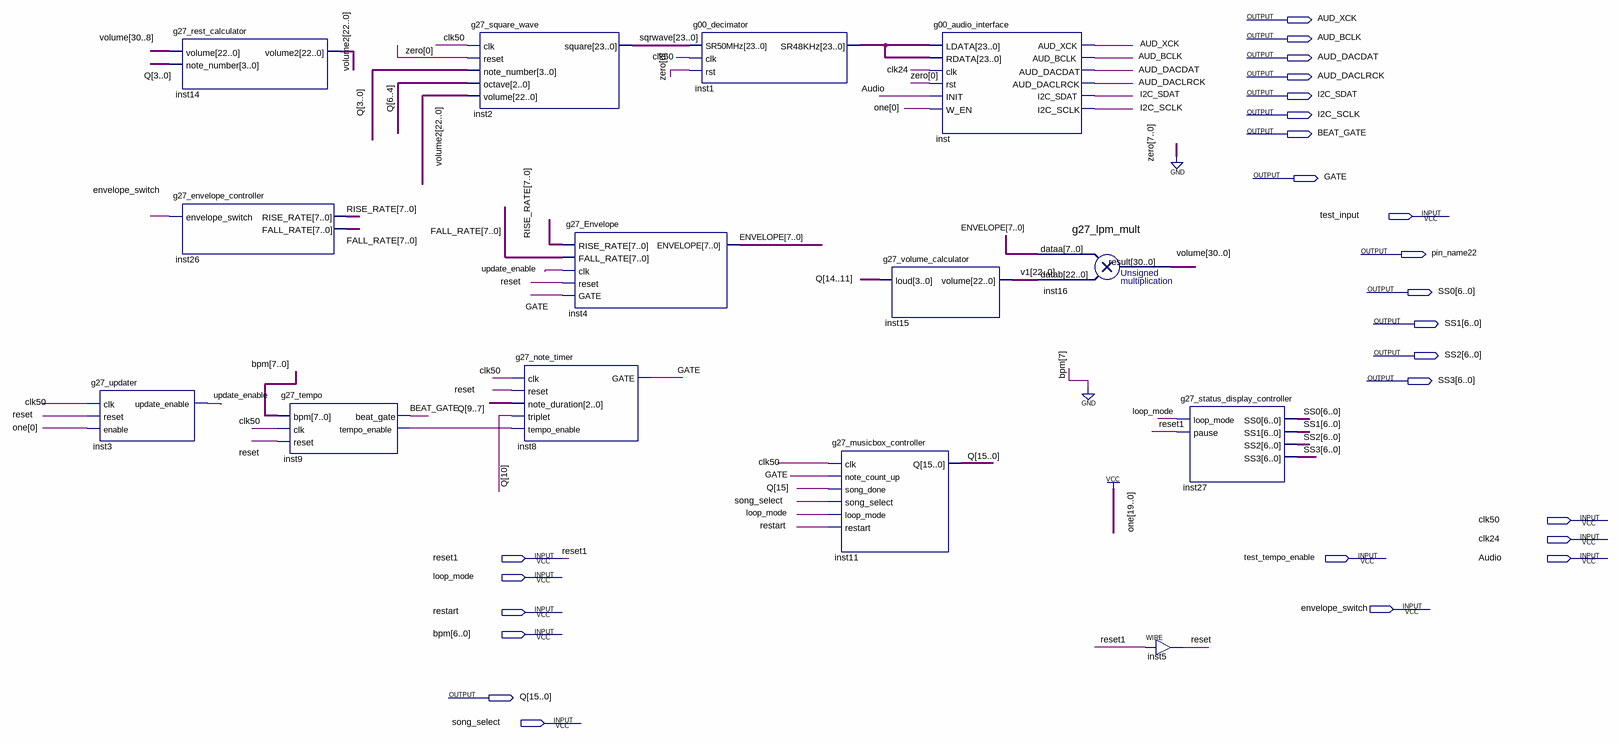
[diagram p0: schematic sheet]
// Quartus schematic g27_complete_design.bdf as structural Verilog: 14 symbols, 25 pins
module g27_complete_design (
  input  test_input,
  input  clk50,
  input  clk24,
  input  reset1,
  input  test_tempo_enable,
  input  Audio,
  input  loop_mode,
  input  envelope_switch,
  input  restart,
  input  [6:0] bpm,
  input  song_select,
  output AUD_XCK,
  output AUD_BCLK,
  output AUD_DACDAT,
  output AUD_DACLRCK,
  output I2C_SDAT,
  output I2C_SCLK,
  output BEAT_GATE,
  output GATE,
  output pin_name22,
  output [6:0] SS0,
  output [6:0] SS1,
  output [6:0] SS2,
  output [6:0] SS3,
  output [15:0] Q
);

  wire inst9_tempo_enable, reset, update_enable;
  wire [7:0] ENVELOPE, FALL_RATE, RISE_RATE;
  wire [22:0] v1, volume2;
  wire [23:0] inst1_sr48khz, sqrwave;
  wire [30:0] volume;

  g27_updater inst3 (.clk(clk50), .reset(reset), .enable(1'b1), .update_enable(update_enable));
  g27_rest_calculator inst14 (.volume(volume[30:8]), .note_number(Q[3:0]), .volume2(volume2));
  g27_envelope_controller inst26 (.envelope_switch(envelope_switch), .RISE_RATE(RISE_RATE), .FALL_RATE(FALL_RATE));
  g27_tempo inst9 (
    .bpm({1'b0, bpm}), .clk(clk50), .reset(reset), .beat_gate(BEAT_GATE), .tempo_enable(inst9_tempo_enable));
  g27_square_wave inst2 (
    .clk(clk50), .reset(1'b0), .note_number(Q[3:0]), .octave(Q[6:4]), .volume(volume2), .square(sqrwave));
  g27_note_timer inst8 (
    .clk(clk50), .reset(reset), .note_duration(Q[9:7]), .triplet(Q[10]), .tempo_enable(inst9_tempo_enable),
    .GATE(GATE));
  g27_Envelope inst4 (
    .RISE_RATE(RISE_RATE), .FALL_RATE(FALL_RATE), .clk(update_enable), .reset(reset), .GATE(GATE),
    .ENVELOPE(ENVELOPE));
  g00_decimator inst1 (.SR50MHz(sqrwave), .clk(clk50), .rst(1'b0), .SR48KHz(inst1_sr48khz));
  g27_musicbox_controller inst11 (
    .clk(clk50), .note_count_up(GATE), .song_done(Q[15]), .song_select(song_select), .loop_mode(loop_mode),
    .restart(restart), .Q(Q));
  g27_volume_calculator inst15 (.loud(Q[14:11]), .volume(v1));
  g00_audio_interface inst (
    .LDATA(inst1_sr48khz), .RDATA(inst1_sr48khz), .clk(clk24), .rst(1'b0), .INIT(Audio), .W_EN(1'b1),
    .AUD_XCK(AUD_XCK), .AUD_BCLK(AUD_BCLK), .AUD_DACDAT(AUD_DACDAT), .AUD_DACLRCK(AUD_DACLRCK),
    .I2C_SDAT(I2C_SDAT), .I2C_SCLK(I2C_SCLK));
  g27_lpm_mult inst16 (.dataa(ENVELOPE), .datab(v1), .result(volume));
  g27_status_display_controller inst27 (
    .loop_mode(loop_mode), .pause(reset1), .SS0(SS0), .SS1(SS1), .SS2(SS2), .SS3(SS3));
  assign reset = reset1;  // WIRE inst5
endmodule
